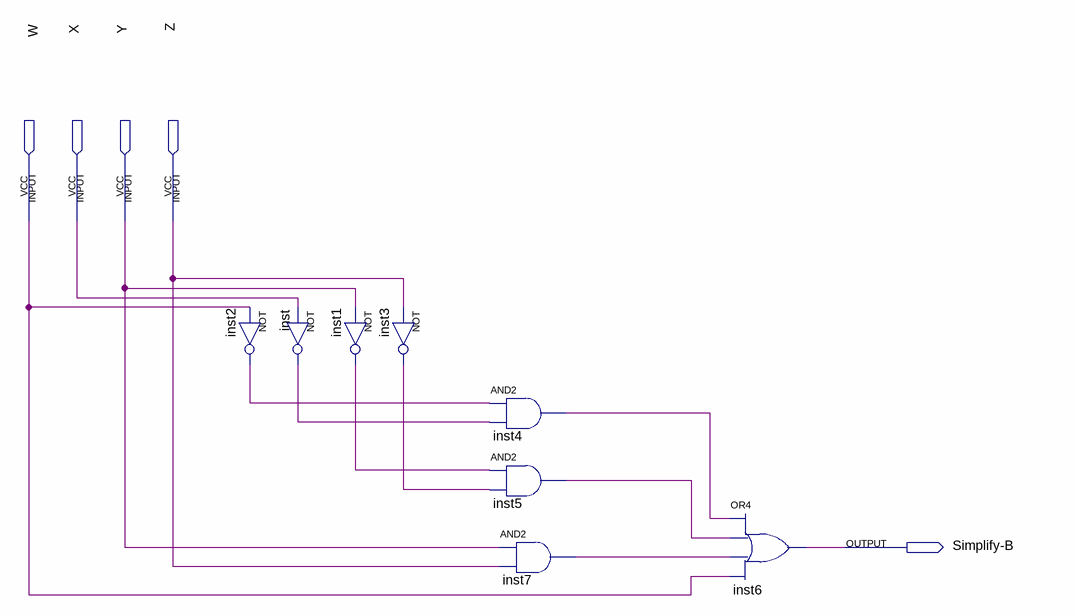
[diagram p0: schematic sheet]
// Quartus schematic Simplify-B.bdf as structural Verilog: 8 symbols, 5 pins
module \Simplify-B  (
  input  W,
  input  X,
  input  Y,
  input  Z,
  output \Simplify-B 
);

  wire inst1_out, inst2_out, inst3_out, inst4_out, inst5_out, inst7_out, inst_out;

  not inst (inst_out, X);
  not inst2 (inst2_out, W);
  not inst1 (inst1_out, Y);
  not inst3 (inst3_out, Z);
  and inst4 (inst4_out, inst2_out, inst_out);
  and inst5 (inst5_out, inst1_out, inst3_out);
  and inst7 (inst7_out, Y, Z);
  or inst6 (\Simplify-B , inst4_out, inst5_out, inst7_out, W);
endmodule
